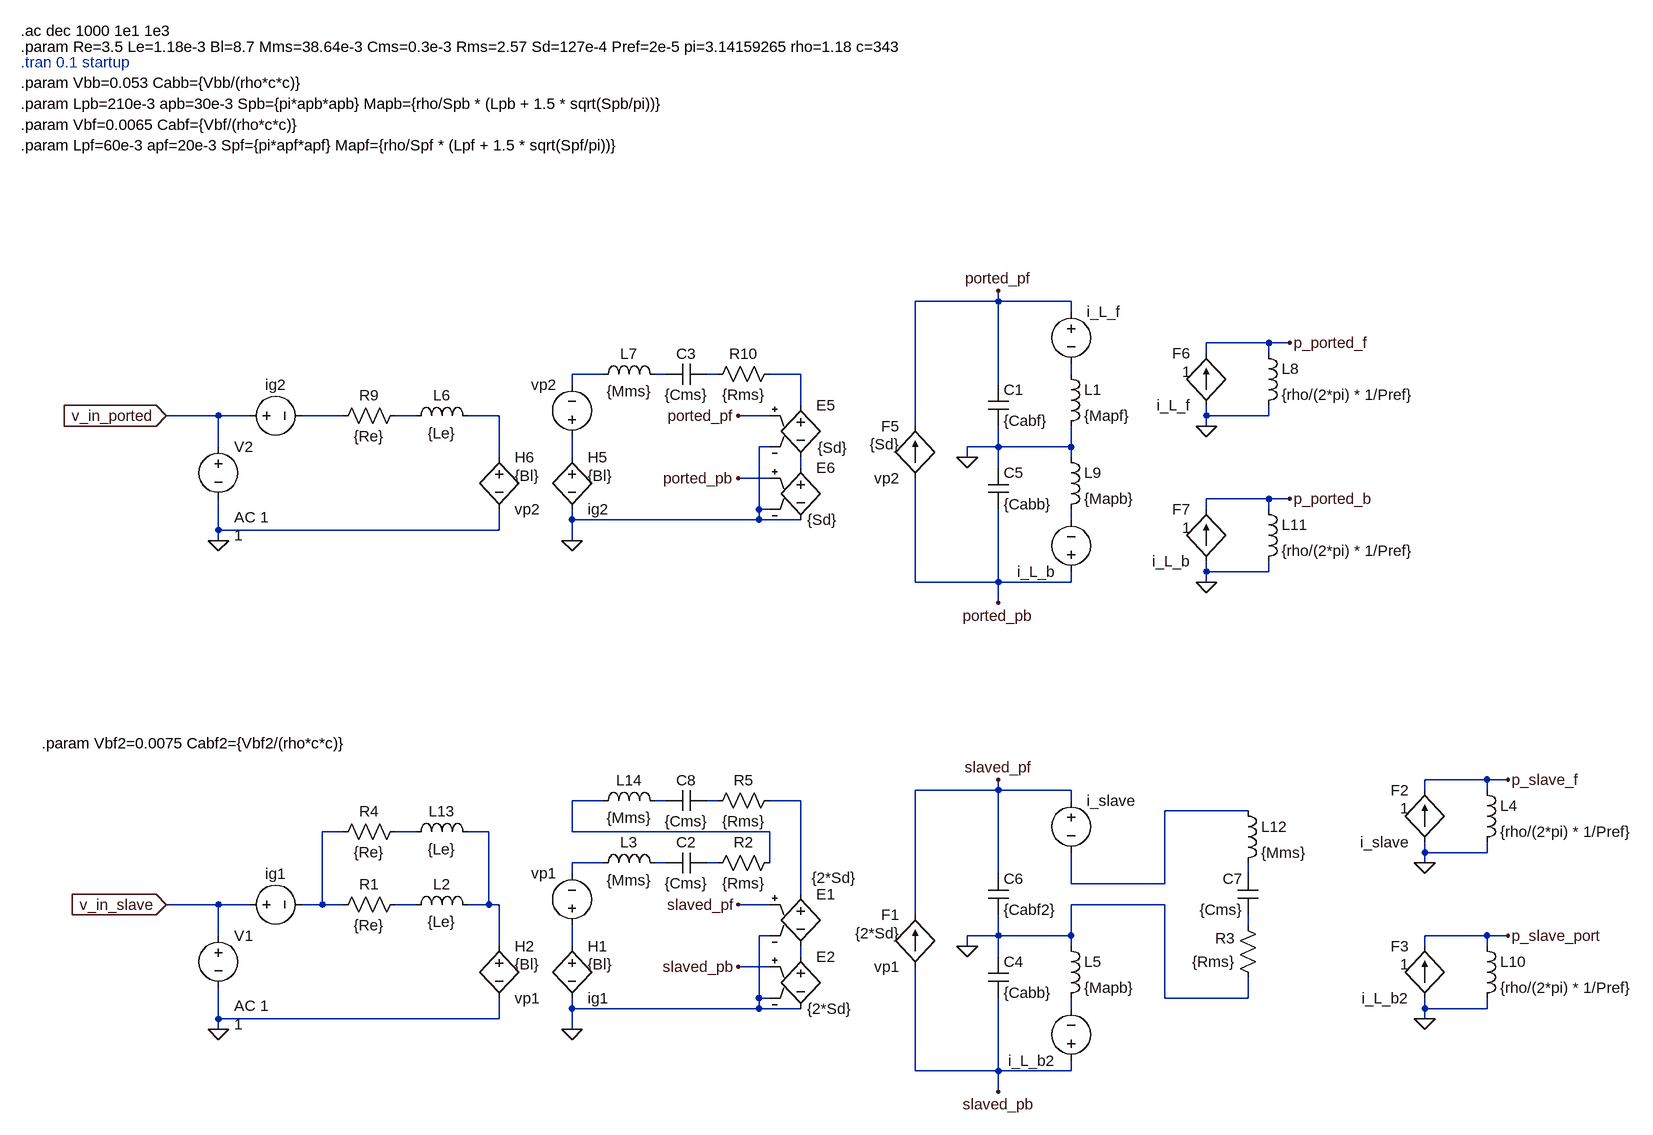
[diagram p0: schematic sim_6th_order.asc]
sim_6th_order.asc, the LTspice schematic file:
Version 4
SHEET 1 2536 1124
WIRE 1328 -432 1328 -448
WIRE 1328 -432 1200 -432
WIRE 1440 -432 1328 -432
WIRE 1440 -416 1440 -432
WIRE 1744 -368 1648 -368
WIRE 1776 -368 1744 -368
WIRE 1648 -352 1648 -368
WIRE 1744 -352 1744 -368
WIRE 720 -320 672 -320
WIRE 816 -320 800 -320
WIRE 896 -320 880 -320
WIRE 1024 -320 976 -320
WIRE 1440 -320 1440 -336
WIRE 672 -304 672 -320
WIRE 1328 -304 1328 -432
WIRE 1024 -272 1024 -320
WIRE 128 -256 48 -256
WIRE 176 -256 128 -256
WIRE 320 -256 256 -256
WIRE 432 -256 400 -256
WIRE 560 -256 512 -256
WIRE 976 -256 928 -256
WIRE 1648 -256 1648 -272
WIRE 1744 -256 1744 -272
WIRE 1744 -256 1648 -256
WIRE 1200 -240 1200 -432
WIRE 1648 -240 1648 -256
WIRE 128 -208 128 -256
WIRE 976 -208 960 -208
WIRE 1328 -208 1328 -240
WIRE 1328 -208 1280 -208
WIRE 1440 -208 1440 -240
WIRE 1440 -208 1328 -208
WIRE 560 -192 560 -256
WIRE 672 -192 672 -224
WIRE 1280 -192 1280 -208
WIRE 1440 -192 1440 -208
WIRE 1024 -176 1024 -192
WIRE 1328 -176 1328 -208
WIRE 976 -160 928 -160
WIRE 1744 -128 1648 -128
WIRE 1776 -128 1744 -128
WIRE 960 -112 960 -208
WIRE 976 -112 960 -112
WIRE 1648 -112 1648 -128
WIRE 1744 -112 1744 -128
WIRE 672 -96 672 -112
WIRE 960 -96 960 -112
WIRE 960 -96 672 -96
WIRE 1024 -96 960 -96
WIRE 1440 -96 1440 -112
WIRE 128 -80 128 -128
WIRE 560 -80 560 -112
WIRE 560 -80 128 -80
WIRE 128 -64 128 -80
WIRE 672 -64 672 -96
WIRE 1648 -16 1648 -32
WIRE 1744 -16 1744 -32
WIRE 1744 -16 1648 -16
WIRE 1200 0 1200 -160
WIRE 1328 0 1328 -112
WIRE 1328 0 1200 0
WIRE 1440 0 1440 -16
WIRE 1440 0 1328 0
WIRE 1648 0 1648 -16
WIRE 1328 32 1328 0
WIRE 2080 304 1984 304
WIRE 2112 304 2080 304
WIRE 1328 320 1328 304
WIRE 1328 320 1200 320
WIRE 1440 320 1328 320
WIRE 1984 320 1984 304
WIRE 2080 320 2080 304
WIRE 720 336 672 336
WIRE 816 336 800 336
WIRE 896 336 880 336
WIRE 1024 336 976 336
WIRE 1440 336 1440 320
WIRE 1712 352 1584 352
WIRE 320 384 288 384
WIRE 432 384 400 384
WIRE 544 384 512 384
WIRE 672 384 672 336
WIRE 976 384 672 384
WIRE 1984 416 1984 400
WIRE 2080 416 2080 400
WIRE 2080 416 1984 416
WIRE 720 432 672 432
WIRE 816 432 800 432
WIRE 896 432 880 432
WIRE 976 432 976 384
WIRE 1984 432 1984 416
WIRE 672 448 672 432
WIRE 1328 448 1328 320
WIRE 1712 448 1712 432
WIRE 1440 464 1440 416
WIRE 1584 464 1584 352
WIRE 1584 464 1440 464
WIRE 1024 480 1024 336
WIRE 128 496 48 496
WIRE 176 496 128 496
WIRE 288 496 288 384
WIRE 288 496 256 496
WIRE 320 496 288 496
WIRE 432 496 400 496
WIRE 544 496 544 384
WIRE 544 496 512 496
WIRE 560 496 544 496
WIRE 976 496 928 496
WIRE 1584 496 1440 496
WIRE 1200 512 1200 320
WIRE 1712 528 1712 512
WIRE 128 544 128 496
WIRE 976 544 960 544
WIRE 1328 544 1328 512
WIRE 1328 544 1280 544
WIRE 1440 544 1440 496
WIRE 1440 544 1328 544
WIRE 2080 544 1984 544
WIRE 2112 544 2080 544
WIRE 560 560 560 496
WIRE 672 560 672 528
WIRE 1280 560 1280 544
WIRE 1440 560 1440 544
WIRE 1984 560 1984 544
WIRE 2080 560 2080 544
WIRE 1024 576 1024 560
WIRE 1328 576 1328 544
WIRE 976 592 928 592
WIRE 960 640 960 544
WIRE 976 640 960 640
WIRE 1584 640 1584 496
WIRE 1712 640 1712 608
WIRE 1712 640 1584 640
WIRE 672 656 672 640
WIRE 960 656 960 640
WIRE 960 656 672 656
WIRE 1024 656 960 656
WIRE 1440 656 1440 640
WIRE 1984 656 1984 640
WIRE 2080 656 2080 640
WIRE 2080 656 1984 656
WIRE 128 672 128 624
WIRE 560 672 560 640
WIRE 560 672 128 672
WIRE 1984 672 1984 656
WIRE 128 688 128 672
WIRE 672 688 672 656
WIRE 1200 752 1200 592
WIRE 1328 752 1328 640
WIRE 1328 752 1200 752
WIRE 1440 752 1440 736
WIRE 1440 752 1328 752
WIRE 1328 784 1328 752
FLAG 128 -64 0
FLAG 672 -64 0
FLAG 1280 -192 0
FLAG 1648 -240 0
FLAG 1328 -448 ported_pf
FLAG 928 -256 ported_pf
FLAG 928 -160 ported_pb
FLAG 1328 32 ported_pb
FLAG 48 -256 v_in_ported
IOPIN 48 -256 In
FLAG 1776 -368 p_ported_f
FLAG 1648 0 0
FLAG 1776 -128 p_ported_b
FLAG 128 688 0
FLAG 672 688 0
FLAG 1280 560 0
FLAG 1984 432 0
FLAG 1328 304 slaved_pf
FLAG 928 496 slaved_pf
FLAG 928 592 slaved_pb
FLAG 1328 784 slaved_pb
FLAG 48 496 v_in_slave
IOPIN 48 496 In
FLAG 2112 304 p_slave_f
FLAG 1984 672 0
FLAG 2112 544 p_slave_port
SYMBOL voltage 128 -224 R0
WINDOW 3 24 152 Left 2
WINDOW 123 24 124 Left 2
WINDOW 39 0 0 Left 0
SYMATTR Value 1
SYMATTR Value2 AC 1
SYMATTR InstName V2
SYMBOL res 416 -272 R90
WINDOW 0 0 56 VBottom 2
WINDOW 3 32 56 VTop 2
SYMATTR InstName R9
SYMATTR Value {Re}
SYMBOL ind 416 -240 R270
WINDOW 0 32 56 VTop 2
WINDOW 3 5 56 VBottom 2
SYMATTR InstName L6
SYMATTR Value {Le}
SYMBOL voltage 160 -256 R270
WINDOW 0 32 56 VTop 2
WINDOW 3 -32 56 VBottom 2
SYMATTR InstName ig2
SYMATTR Value ""
SYMBOL ind 704 -304 R270
WINDOW 0 32 56 VTop 2
WINDOW 3 5 56 VBottom 2
SYMATTR InstName L7
SYMATTR Value {Mms}
SYMBOL cap 880 -336 R90
WINDOW 0 0 32 VBottom 2
WINDOW 3 32 32 VTop 2
SYMATTR InstName C3
SYMATTR Value {Cms}
SYMBOL res 992 -336 R90
WINDOW 0 0 56 VBottom 2
WINDOW 3 32 56 VTop 2
SYMATTR InstName R10
SYMATTR Value {Rms}
SYMBOL voltage 672 -208 R180
WINDOW 0 24 96 Left 2
WINDOW 3 24 16 Left 2
SYMATTR InstName vp2
SYMATTR Value ""
SYMBOL h 672 -208 R0
WINDOW 123 24 44 Left 2
SYMATTR Value2 {Bl}
SYMATTR InstName H5
SYMATTR Value ig2
SYMBOL h 560 -208 R0
WINDOW 123 24 44 Left 2
SYMATTR Value2 {Bl}
SYMATTR InstName H6
SYMATTR Value vp2
SYMBOL f 1200 -160 R180
WINDOW 0 24 80 Left 2
WINDOW 3 24 0 Left 2
WINDOW 123 24 52 Left 2
SYMATTR InstName F5
SYMATTR Value vp2
SYMATTR Value2 {Sd}
SYMBOL ind 1728 -368 R0
SYMATTR InstName L8
SYMATTR Value {rho/(2*pi) * 1/Pref}
SYMBOL f 1648 -272 R180
WINDOW 0 24 80 Left 2
WINDOW 3 24 0 Left 2
WINDOW 123 24 52 Left 2
SYMATTR InstName F6
SYMATTR Value i_L_f
SYMATTR Value2 1
SYMBOL e 1024 -288 R0
WINDOW 3 26 81 Left 2
SYMATTR InstName E5
SYMATTR Value {Sd}
SYMBOL e 1024 -192 R0
WINDOW 3 10 96 Left 2
SYMATTR InstName E6
SYMATTR Value {Sd}
SYMBOL cap 1312 -176 R0
SYMATTR InstName C5
SYMATTR Value {Cabb}
SYMBOL ind 1424 -208 R0
SYMATTR InstName L9
SYMATTR Value {Mapb}
SYMBOL ind 1728 -128 R0
SYMATTR InstName L11
SYMATTR Value {rho/(2*pi) * 1/Pref}
SYMBOL f 1648 -32 R180
WINDOW 0 24 80 Left 2
WINDOW 3 24 0 Left 2
WINDOW 123 24 52 Left 2
SYMATTR InstName F7
SYMATTR Value i_L_b
SYMATTR Value2 1
SYMBOL voltage 1440 0 R180
WINDOW 123 0 0 Left 0
WINDOW 39 0 0 Left 0
SYMATTR InstName i_L_b
SYMATTR Value ""
SYMBOL cap 1312 -304 R0
SYMATTR InstName C1
SYMATTR Value {Cabf}
SYMBOL ind 1424 -336 R0
SYMATTR InstName L1
SYMATTR Value {Mapf}
SYMBOL voltage 1440 -432 R0
WINDOW 123 0 0 Left 0
WINDOW 39 0 0 Left 0
SYMATTR InstName i_L_f
SYMATTR Value ""
SYMBOL voltage 128 528 R0
WINDOW 3 24 152 Left 2
WINDOW 123 24 124 Left 2
WINDOW 39 0 0 Left 0
SYMATTR Value 1
SYMATTR Value2 AC 1
SYMATTR InstName V1
SYMBOL res 416 480 R90
WINDOW 0 0 56 VBottom 2
WINDOW 3 32 56 VTop 2
SYMATTR InstName R1
SYMATTR Value {Re}
SYMBOL ind 416 512 R270
WINDOW 0 32 56 VTop 2
WINDOW 3 5 56 VBottom 2
SYMATTR InstName L2
SYMATTR Value {Le}
SYMBOL voltage 160 496 R270
WINDOW 0 32 56 VTop 2
WINDOW 3 -32 56 VBottom 2
SYMATTR InstName ig1
SYMATTR Value ""
SYMBOL ind 704 448 R270
WINDOW 0 32 56 VTop 2
WINDOW 3 5 56 VBottom 2
SYMATTR InstName L3
SYMATTR Value {Mms}
SYMBOL cap 880 416 R90
WINDOW 0 0 32 VBottom 2
WINDOW 3 32 32 VTop 2
SYMATTR InstName C2
SYMATTR Value {Cms}
SYMBOL res 992 416 R90
WINDOW 0 0 56 VBottom 2
WINDOW 3 32 56 VTop 2
SYMATTR InstName R2
SYMATTR Value {Rms}
SYMBOL voltage 672 544 R180
WINDOW 0 24 96 Left 2
WINDOW 3 24 16 Left 2
SYMATTR InstName vp1
SYMATTR Value ""
SYMBOL h 672 544 R0
WINDOW 123 24 44 Left 2
SYMATTR Value2 {Bl}
SYMATTR InstName H1
SYMATTR Value ig1
SYMBOL h 560 544 R0
WINDOW 123 24 44 Left 2
SYMATTR Value2 {Bl}
SYMATTR InstName H2
SYMATTR Value vp1
SYMBOL f 1200 592 R180
WINDOW 0 24 80 Left 2
WINDOW 3 24 0 Left 2
WINDOW 123 24 52 Left 2
SYMATTR InstName F1
SYMATTR Value vp1
SYMATTR Value2 {2*Sd}
SYMBOL ind 2064 304 R0
SYMATTR InstName L4
SYMATTR Value {rho/(2*pi) * 1/Pref}
SYMBOL f 1984 400 R180
WINDOW 0 24 80 Left 2
WINDOW 3 24 0 Left 2
WINDOW 123 24 52 Left 2
SYMATTR InstName F2
SYMATTR Value i_slave
SYMATTR Value2 1
SYMBOL e 1024 464 R0
WINDOW 3 17 -9 Left 2
SYMATTR InstName E1
SYMATTR Value {2*Sd}
SYMBOL e 1024 560 R0
WINDOW 3 10 96 Left 2
SYMATTR InstName E2
SYMATTR Value {2*Sd}
SYMBOL cap 1312 576 R0
SYMATTR InstName C4
SYMATTR Value {Cabb}
SYMBOL ind 1424 544 R0
SYMATTR InstName L5
SYMATTR Value {Mapb}
SYMBOL ind 2064 544 R0
SYMATTR InstName L10
SYMATTR Value {rho/(2*pi) * 1/Pref}
SYMBOL f 1984 640 R180
WINDOW 0 24 80 Left 2
WINDOW 3 24 0 Left 2
WINDOW 123 24 52 Left 2
SYMATTR InstName F3
SYMATTR Value i_L_b2
SYMATTR Value2 1
SYMBOL voltage 1440 752 R180
WINDOW 123 0 0 Left 0
WINDOW 39 0 0 Left 0
SYMATTR InstName i_L_b2
SYMATTR Value ""
SYMBOL cap 1312 448 R0
SYMATTR InstName C6
SYMATTR Value {Cabf2}
SYMBOL voltage 1440 320 R0
WINDOW 123 0 0 Left 0
WINDOW 39 0 0 Left 0
SYMATTR InstName i_slave
SYMATTR Value ""
SYMBOL ind 1696 336 R0
SYMATTR InstName L12
SYMATTR Value {Mms}
SYMBOL cap 1728 512 R180
WINDOW 0 24 56 Left 2
WINDOW 3 24 8 Left 2
SYMATTR InstName C7
SYMATTR Value {Cms}
SYMBOL res 1728 624 R180
WINDOW 0 36 76 Left 2
WINDOW 3 36 40 Left 2
SYMATTR InstName R3
SYMATTR Value {Rms}
SYMBOL res 416 368 R90
WINDOW 0 0 56 VBottom 2
WINDOW 3 32 56 VTop 2
SYMATTR InstName R4
SYMATTR Value {Re}
SYMBOL ind 416 400 R270
WINDOW 0 32 56 VTop 2
WINDOW 3 5 56 VBottom 2
SYMATTR InstName L13
SYMATTR Value {Le}
SYMBOL ind 704 352 R270
WINDOW 0 32 56 VTop 2
WINDOW 3 5 56 VBottom 2
SYMATTR InstName L14
SYMATTR Value {Mms}
SYMBOL cap 880 320 R90
WINDOW 0 0 32 VBottom 2
WINDOW 3 32 32 VTop 2
SYMATTR InstName C8
SYMATTR Value {Cms}
SYMBOL res 992 320 R90
WINDOW 0 0 56 VBottom 2
WINDOW 3 32 56 VTop 2
SYMATTR InstName R5
SYMATTR Value {Rms}
TEXT -176 -848 Left 2 !.ac dec 1000 1e1 1e3
TEXT -176 -824 Left 2 !.param Re=3.5 Le=1.18e-3 Bl=8.7 Mms=38.64e-3 Cms=0.3e-3 Rms=2.57 Sd=127e-4 Pref=2e-5 pi=3.14159265 rho=1.18 c=343
TEXT -176 -800 Left 2 ;.tran 0.1 startup
TEXT -176 -768 Left 2 !.param Vbb=0.053 Cabb={Vbb/(rho*c*c)}
TEXT -176 -736 Left 2 !.param Lpb=210e-3 apb=30e-3 Spb={pi*apb*apb} Mapb={rho/Spb * (Lpb + 1.5 * sqrt(Spb/pi))}
TEXT -176 -704 Left 2 !.param Vbf=0.0065 Cabf={Vbf/(rho*c*c)}
TEXT -176 -672 Left 2 !.param Lpf=60e-3 apf=20e-3 Spf={pi*apf*apf} Mapf={rho/Spf * (Lpf + 1.5 * sqrt(Spf/pi))}
TEXT -144 248 Left 2 !.param Vbf2=0.0075 Cabf2={Vbf2/(rho*c*c)}

The netlist it stands for:
* sim_6th_order.asc
V2 v_in_ported 0 1 AC 1
R9 N007 N006 {Re}
L6 N007 N008 {Le}
V§ig2 v_in_ported N006
L7 N001 N002 {Mms}
C3 N003 N002 {Cms}
R10 N004 N003 {Rms}
vp2 N009 N001
H5 N009 0 ig2 {Bl}
H6 N008 0 vp2 {Bl}
F5 ported_pb ported_pf vp2 {Sd}
L8 p_ported_f 0 {rho/(2*pi) * 1/Pref}
F6 0 p_ported_f i_L_f 1
E5 N004 N010 ported_pf 0 {Sd}
E6 N010 0 ported_pb 0 {Sd}
C5 0 ported_pb {Cabb}
L9 0 N011 {Mapb}
L11 p_ported_b 0 {rho/(2*pi) * 1/Pref}
F7 0 p_ported_b i_L_b 1
V§i_L_b ported_pb N011
C1 ported_pf 0 {Cabf}
L1 N005 0 {Mapf}
V§i_L_f ported_pf N005
V1 v_in_slave 0 1 AC 1
R1 N024 N017 {Re}
L2 N024 N019 {Le}
V§ig1 v_in_slave N017
L3 N020 N021 {Mms}
C2 N022 N021 {Cms}
R2 N012 N022 {Rms}
vp1 N026 N020
H1 N026 0 ig1 {Bl}
H2 N019 0 vp1 {Bl}
F1 slaved_pb slaved_pf vp1 {2*Sd}
L4 p_slave_f 0 {rho/(2*pi) * 1/Pref}
F2 0 p_slave_f i_slave 1
E1 N015 N027 slaved_pf 0 {2*Sd}
E2 N027 0 slaved_pb 0 {2*Sd}
C4 0 slaved_pb {Cabb}
L5 0 N028 {Mapb}
L10 p_slave_port 0 {rho/(2*pi) * 1/Pref}
F3 0 p_slave_port i_L_b2 1
V§i_L_b2 slaved_pb N028
C6 slaved_pf 0 {Cabf2}
V§i_slave slaved_pf N016
L12 N016 N023 {Mms}
C7 N025 N023 {Cms}
R3 0 N025 {Rms}
R4 N018 N017 {Re}
L13 N018 N019 {Le}
L14 N012 N013 {Mms}
C8 N014 N013 {Cms}
R5 N015 N014 {Rms}
.ac dec 1000 1e1 1e3
.param Re=3.5 Le=1.18e-3 Bl=8.7 Mms=38.64e-3 Cms=0.3e-3 Rms=2.57 Sd=127e-4 Pref=2e-5 pi=3.14159265 rho=1.18 c=343
* .tran 0.1 startup
.param Vbb=0.053 Cabb={Vbb/(rho*c*c)}
.param Lpb=210e-3 apb=30e-3 Spb={pi*apb*apb} Mapb={rho/Spb * (Lpb + 1.5 * sqrt(Spb/pi))}
.param Vbf=0.0065 Cabf={Vbf/(rho*c*c)}
.param Lpf=60e-3 apf=20e-3 Spf={pi*apf*apf} Mapf={rho/Spf * (Lpf + 1.5 * sqrt(Spf/pi))}
.param Vbf2=0.0075 Cabf2={Vbf2/(rho*c*c)}
.backanno
.end

* Results of the author's LTspice run, read from the files saved beside the schematic
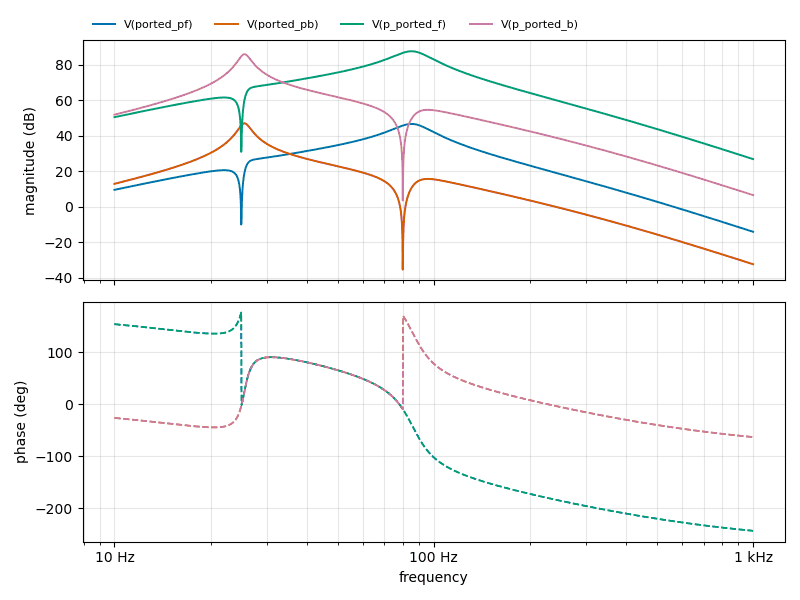
[diagram p1: AC Analysis of sim_6th_order.asc, plotted from the saved traces]
* AC Analysis, 1 run:
*   V(ported_pf): 9.52 dB at 10 Hz, -14.09 dB at 1 kHz, peak 46.62 dB at 85.11 Hz, 3 dB below the peak at 74.56 Hz and 95.93 Hz
*   V(ported_pb): 12.90 dB at 10 Hz, -32.37 dB at 1 kHz, peak 46.97 dB at 25.53 Hz, 3 dB below the peak at 24.52 Hz and 26.65 Hz
*   V(p_ported_f): 50.43 dB at 10 Hz, 26.82 dB at 1 kHz, peak 87.54 dB at 85.11 Hz, 3 dB below the peak at 74.56 Hz and 95.93 Hz
*   V(p_ported_b): 51.82 dB at 10 Hz, 6.54 dB at 1 kHz, peak 85.88 dB at 25.53 Hz, 3 dB below the peak at 24.52 Hz and 26.65 Hz